# Altium project InterfacePCB.PrjPcb
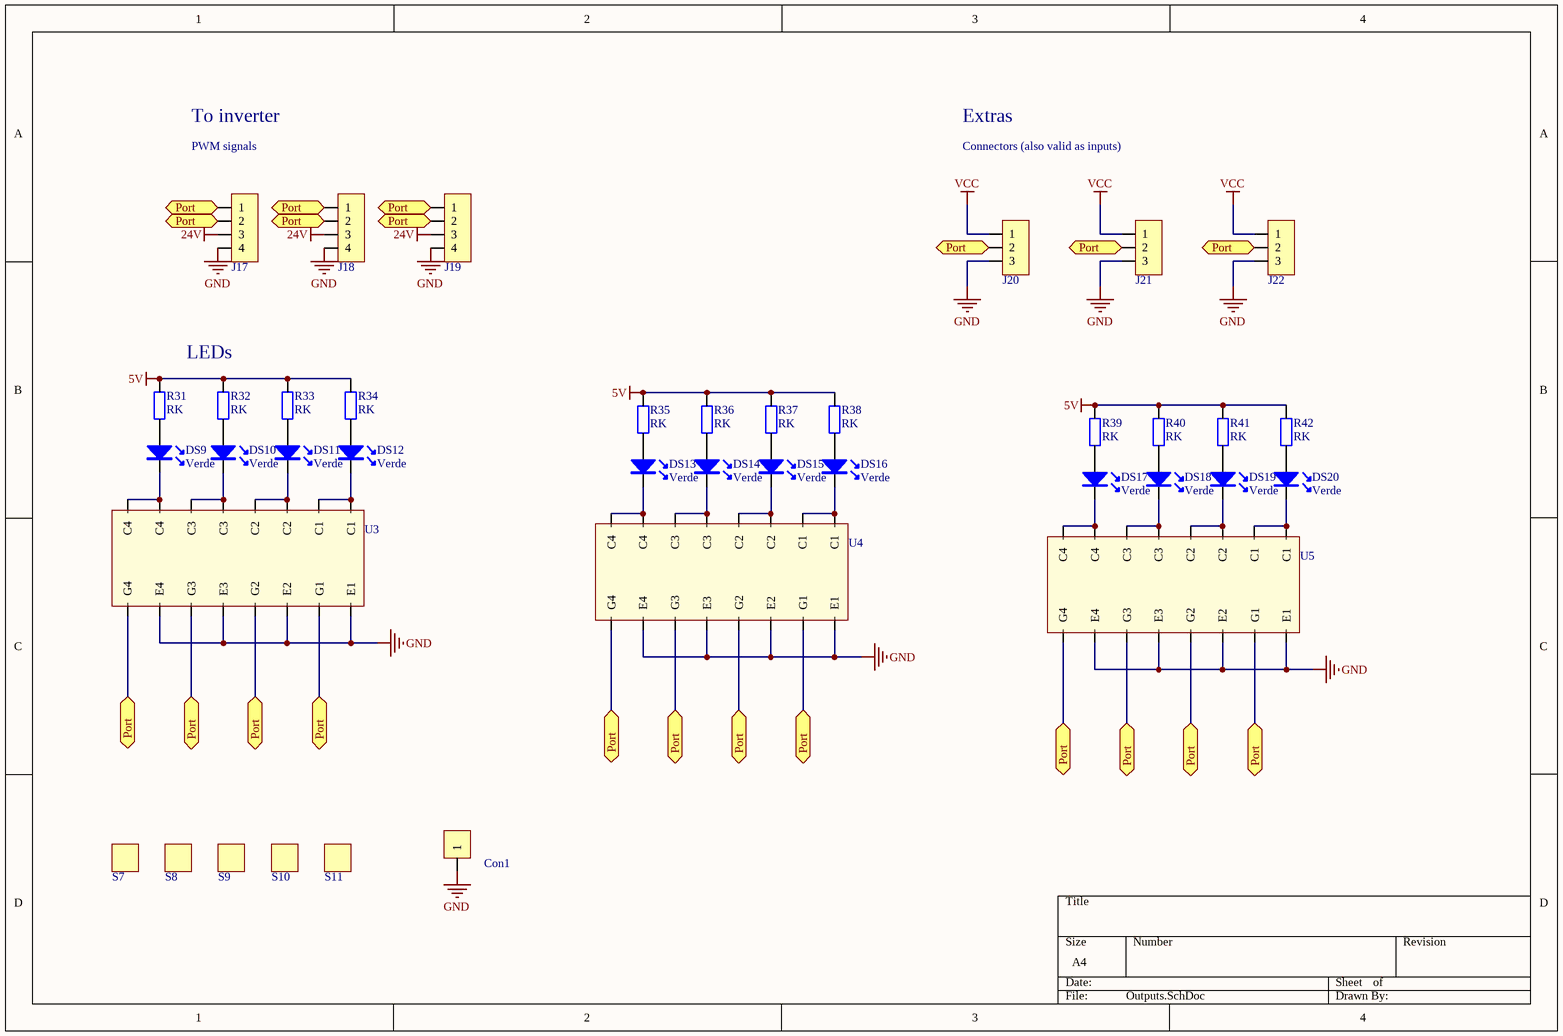
[diagram p0: Outputs.SchDoc]
6 sheets, 190 parts. Net scope: flat (ports and power ports of the same name join across sheets).
Board file: V1_PCB.PcbDoc
Sheets:
  Outputs.SchDoc
  InputsExtras.SchDoc
  DSP.SchDoc
  Supplies.SchDoc
  Inputs.SchDoc
  SignalProcessing.SchDoc

## Sheet Outputs.SchDoc
size A4

### Parts
Con1  CON1  [ShortPad]  (value not drawn)
DS9  Verde  [Led 3mm]
DS10  Verde  [Led 3mm]
DS11  Verde  [Led 3mm]
DS12  Verde  [Led 3mm]
DS13  Verde  [Led 3mm]
DS14  Verde  [Led 3mm]
DS15  Verde  [Led 3mm]
DS16  Verde  [Led 3mm]
DS17  Verde  [Led 3mm]
DS18  Verde  [Led 3mm]
DS19  Verde  [Led 3mm]
DS20  Verde  [Led 3mm]
J17  Cleva 2 vias  [Con4_KK_256]  (value not drawn)
J18  Cleva 2 vias  [Con4_KK_256]  (value not drawn)
J19  Cleva 2 vias  [Con4_KK_256]  (value not drawn)
J20  Cleva 2 vias  [Con3_KK_256]  (value not drawn)
J21  Cleva 2 vias  [Con3_KK_256]  (value not drawn)
J22  Cleva 2 vias  [Con3_KK_256]  (value not drawn)
R31  RK  [1206]
R32  RK  [1206]
R33  RK  [1206]
R34  RK  [1206]
R35  RK  [1206]
R36  RK  [1206]
R37  RK  [1206]
R38  RK  [1206]
R39  RK  [1206]
R40  RK  [1206]
R41  RK  [1206]
R42  RK  [1206]
S7  Support  [Support]  (value not drawn)
S8  Support  [Support]  (value not drawn)
S9  Support  [Support]  (value not drawn)
S10  Support  [Support]  (value not drawn)
S11  Support  [Support]  (value not drawn)
U3  MMPQ3904  [SO-16]  (value not drawn)
U4  MMPQ3904  [SO-16]  (value not drawn)
U5  MMPQ3904  [SO-16]  (value not drawn)

### Ports
Port

### Nets
5V: R31.1 R32.1 R33.1 R34.1 R35.1 R36.1 R37.1 R38.1 R39.1 R40.1 R41.1 R42.1
24V: J17.3 J18.3 J19.3
GND: Con1.1 J17.4 J18.4 J19.4 J20.3 J21.3 J22.3 U3.10(E4) U3.12(E3) U3.14(E2) U3.16(E1) U4.10(E4) U4.12(E3) U4.14(E2) U4.16(E1) U5.10(E4) U5.12(E3) U5.14(E2) U5.16(E1)
VCC: J20.1 J21.1 J22.1
NetC1_1: J17.1 J17.2 J18.1 J18.2 J19.1 J19.2 J20.2 J21.2 J22.2 U3.9(G4) U3.11(G3) U3.13(G2) U3.15(G1) U4.9(G4) U4.11(G3) U4.13(G2) U4.15(G1) U5.9(G4) U5.11(G3) U5.13(G2) U5.15(G1) ; port Port
NetDS9_A: DS9.A R31.2
NetDS9_K: DS9.K U3.7(C4) U3.8(C4)
NetDS10_A: DS10.A R32.2
NetDS10_K: DS10.K U3.5(C3) U3.6(C3)
NetDS11_A: DS11.A R33.2
NetDS11_K: DS11.K U3.3(C2) U3.4(C2)
NetDS12_A: DS12.A R34.2
NetDS12_K: DS12.K U3.1(C1) U3.2(C1)
NetDS13_A: DS13.A R35.2
NetDS13_K: DS13.K U4.7(C4) U4.8(C4)
NetDS14_A: DS14.A R36.2
NetDS14_K: DS14.K U4.5(C3) U4.6(C3)
NetDS15_A: DS15.A R37.2
NetDS15_K: DS15.K U4.3(C2) U4.4(C2)
NetDS16_A: DS16.A R38.2
NetDS16_K: DS16.K U4.1(C1) U4.2(C1)
NetDS17_A: DS17.A R39.2
NetDS17_K: DS17.K U5.7(C4) U5.8(C4)
NetDS18_A: DS18.A R40.2
NetDS18_K: DS18.K U5.5(C3) U5.6(C3)
NetDS19_A: DS19.A R41.2
NetDS19_K: DS19.K U5.3(C2) U5.4(C2)
NetDS20_A: DS20.A R42.2
NetDS20_K: DS20.K U5.1(C1) U5.2(C1)

### Notes on the sheet
- (near J17) PWM signals
- To inverter
- Extras
- Connectors (also valid as inputs)
- LEDs

### Library data of the parts
DS9-DS20 = Led
J17-J19 = Con_4
J20-J22 = Con_3
R31-R42 = Resistencia: Potencia: 1/4W

## Sheet InputsExtras.SchDoc
size A4
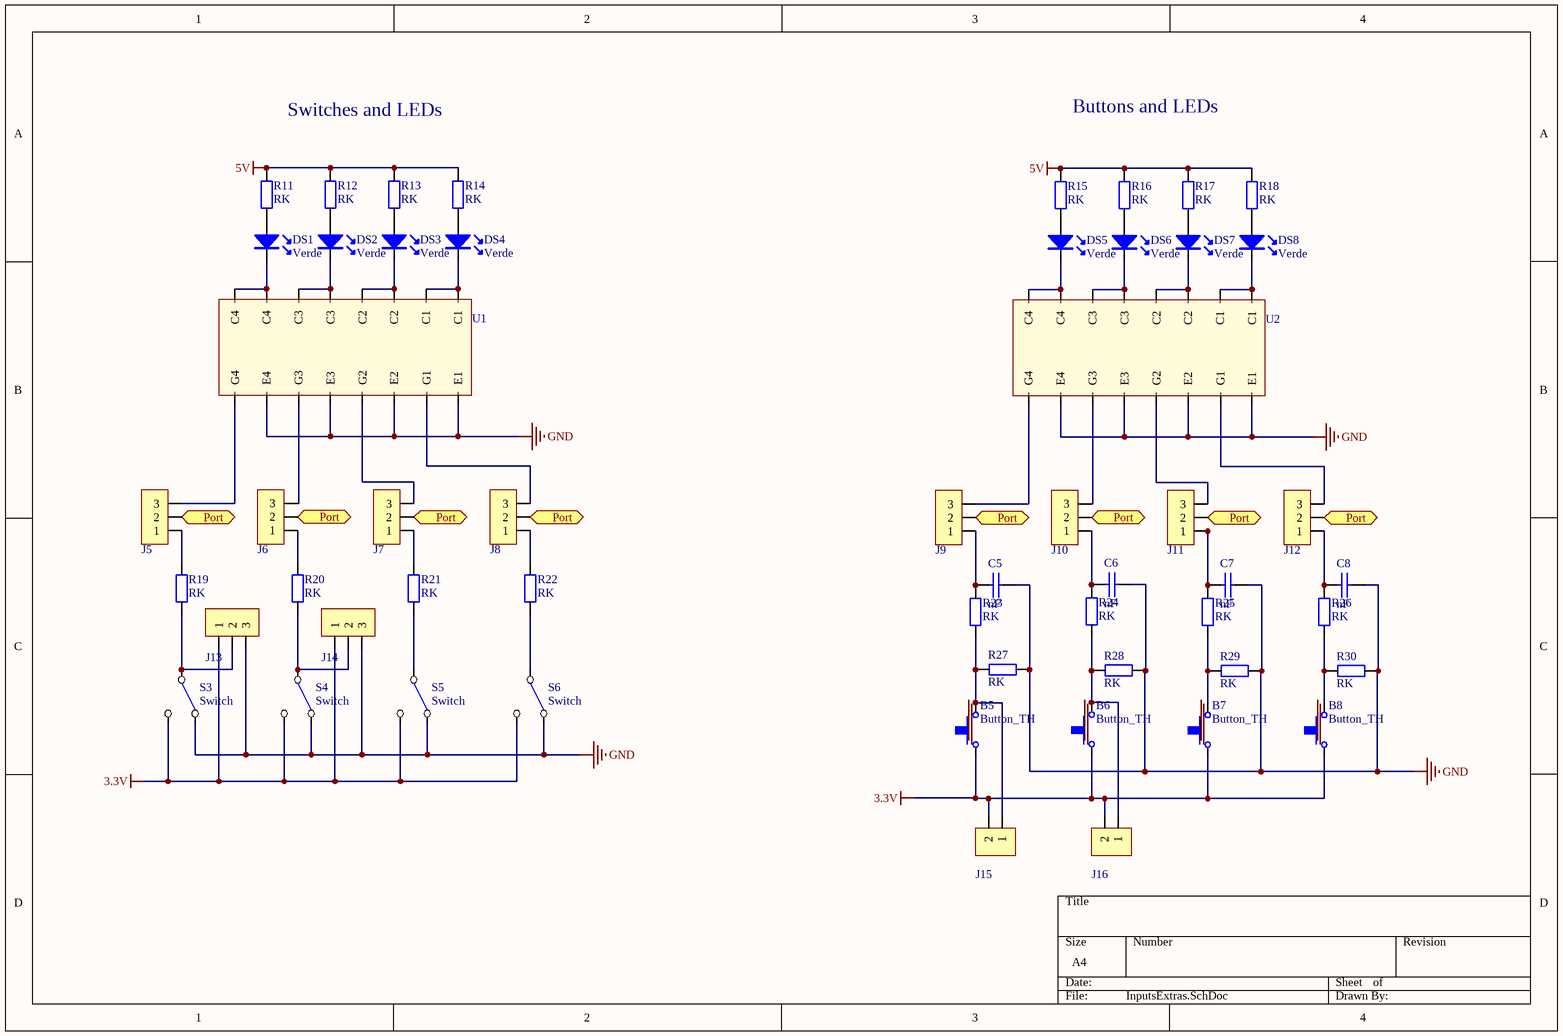
[diagram p1: InputsExtras.SchDoc]

### Parts
B5  Button_TH  [ButtonTH]
B6  Button_TH  [ButtonTH]
B7  Button_TH  [ButtonTH]
B8  Button_TH  [ButtonTH]
C5  nF  [1206]
C6  nF  [1206]
C7  nF  [1206]
C8  nF  [1206]
DS1  Verde  [Led 3mm]
DS2  Verde  [Led 3mm]
DS3  Verde  [Led 3mm]
DS4  Verde  [Led 3mm]
DS5  Verde  [Led 3mm]
DS6  Verde  [Led 3mm]
DS7  Verde  [Led 3mm]
DS8  Verde  [Led 3mm]
J5  Cleva 2 vias  [con_3_100milis]  (value not drawn)
J6  Cleva 2 vias  [con_3_100milis]  (value not drawn)
J7  Cleva 2 vias  [con_3_100milis]  (value not drawn)
J8  Cleva 2 vias  [con_3_100milis]  (value not drawn)
J9  Cleva 2 vias  [con_3_100milis]  (value not drawn)
J10  Cleva 2 vias  [con_3_100milis]  (value not drawn)
J11  Cleva 2 vias  [con_3_100milis]  (value not drawn)
J12  Cleva 2 vias  [con_3_100milis]  (value not drawn)
J13  Cleva 2 vias  [Con3_KK_256]  (value not drawn)
J14  Cleva 2 vias  [Con3_KK_256]  (value not drawn)
J15  Cleva 2 vias  [Con2_KK_256]  (value not drawn)
J16  Cleva 2 vias  [Con2_KK_256]  (value not drawn)
R11  RK  [1206]
R12  RK  [1206]
R13  RK  [1206]
R14  RK  [1206]
R15  RK  [1206]
R16  RK  [1206]
R17  RK  [1206]
R18  RK  [1206]
R19  RK  [1206]
R20  RK  [1206]
R21  RK  [1206]
R22  RK  [1206]
R23  RK  [1206]
R24  RK  [1206]
R25  RK  [1206]
R26  RK  [1206]
R27  RK  [1206]
R28  RK  [1206]
R29  RK  [1206]
R30  RK  [1206]
S3  Switch  [SwitchTH_2Pos]
S4  Switch  [SwitchTH_2Pos]
S5  Switch  [SwitchTH_2Pos]
S6  Switch  [SwitchTH_2Pos]
U1  MMPQ3904  [SO-16]  (value not drawn)
U2  MMPQ3904  [SO-16]  (value not drawn)

### Ports
Port

### Nets
3.3V: B5.1 B6.1 B7.1 B8.1 J13.1 J14.1 J15.2 J16.2 S3.2(ON2) S4.2(ON2) S5.2(ON2) S6.2(ON2)
5V: R11.1 R12.1 R13.1 R14.1 R15.1 R16.1 R17.1 R18.1
GND: C5.1 C6.1 C7.1 C8.1 J13.3 J14.3 R27.1 R28.1 R29.1 R30.1 S3.0(ON1) S4.0(ON1) S5.0(ON1) S6.0(ON1) U1.10(E4) U1.12(E3) U1.14(E2) U1.16(E1) U2.10(E4) U2.12(E3) U2.14(E2) U2.16(E1)
NetB5_0: B5.0 J15.1 R23.1 R27.2
NetB6_0: B6.0 J16.1 R24.1 R28.2
NetB7_0: B7.0 R25.1 R29.2
NetB8_0: B8.0 R26.1 R30.2
NetC1_1: J5.2 J6.2 J7.2 J8.2 J9.2 J10.2 J11.2 J12.2 ; port Port
NetC5_2: C5.2 J9.1 R23.2
NetC6_2: C6.2 J10.1 R24.2
NetC7_2: C7.2 J11.1 R25.2
NetC8_2: C8.2 J12.1 R26.2
NetDS1_A: DS1.A R11.2
NetDS1_K: DS1.K U1.7(C4) U1.8(C4)
NetDS2_A: DS2.A R12.2
NetDS2_K: DS2.K U1.5(C3) U1.6(C3)
NetDS3_A: DS3.A R13.2
NetDS3_K: DS3.K U1.3(C2) U1.4(C2)
NetDS4_A: DS4.A R14.2
NetDS4_K: DS4.K U1.1(C1) U1.2(C1)
NetDS5_A: DS5.A R15.2
NetDS5_K: DS5.K U2.7(C4) U2.8(C4)
NetDS6_A: DS6.A R16.2
NetDS6_K: DS6.K U2.5(C3) U2.6(C3)
NetDS7_A: DS7.A R17.2
NetDS7_K: DS7.K U2.3(C2) U2.4(C2)
NetDS8_A: DS8.A R18.2
NetDS8_K: DS8.K U2.1(C1) U2.2(C1)
NetJ5_1: J5.1 R19.2
NetJ5_3: J5.3 U1.9(G4)
NetJ6_1: J6.1 R20.2
NetJ6_3: J6.3 U1.11(G3)
NetJ7_1: J7.1 R21.2
NetJ7_3: J7.3 U1.13(G2)
NetJ8_1: J8.1 R22.2
NetJ8_3: J8.3 U1.15(G1)
NetJ9_3: J9.3 U2.9(G4)
NetJ10_3: J10.3 U2.11(G3)
NetJ11_3: J11.3 U2.13(G2)
NetJ12_3: J12.3 U2.15(G1)
NetJ13_2: J13.2 R19.1 S3.1(COMMON)
NetJ14_2: J14.2 R20.1 S4.1(COMMON)
NetR21_1: R21.1 S5.1(COMMON)
NetR22_1: R22.1 S6.1(COMMON)

### Notes on the sheet
- Buttons and LEDs
- Switches and LEDs

### Library data of the parts
C5-C8 = Condensador
DS1-DS8 = Led
J5-J14 = Con_3
J15 J16 = Con_2
R11-R30 = Resistencia: Potencia: 1/4W

## Sheet DSP.SchDoc
size A4
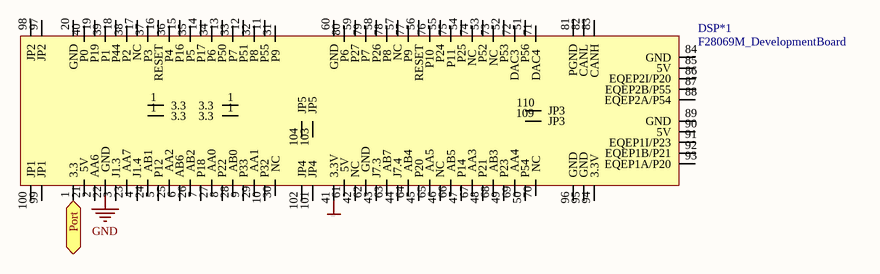
[diagram p2: DSP.SchDoc]

### Parts
DSP*1  F28069M_DevelopmentBoard  [F28069M_DevelopmentBoard]

### Ports
Port

### Nets
GND: DSP*1.22(GND)
VCC: DSP*1.41(3.3V)
NetC1_1: DSP*1.1(3.3) ; port Port

Not connected (* = marked no-connect by the designer): DSP*1 2(AA6) 3(J1.3) 4(J1.4) 5(P12) 6(AB6) 7(P18) 8(P22) 9(P33) 10(P32) 11(P55) 12(P51) 13(P50) 14(P17) 15(P16) 16(RESET) 17(NC) 18(P44) 19(P19) 20(GND) 21(5V) 23(AA7) 24(AB1) 25(AA2) 26(AB2) 27(AA0) 28(AB0) 29(AA1) 30(NC) 31(P9) 32(P8) 33(P7) 34(P6) 35(P5) 36(P4) 37(P3) 38(P2) 39(P1) 40(P0) 42(NC) 43(J7.3) 44(J7.4) 45(P20) 46(NC) 47(P14) 48(P21) 49(P23) 50(P54) 51(P56) 52(P53) 53(P52) 54(P25) 55(P24) 56(RESET) 57(NC) 58(P26) 59(P27) 60(GND) 61(5V) 62(GND) 63(AB7) 64(AB4) 65(AA5) 66(AB5) 67(AA3) 68(AB3) 69(AA4) 70(NC) 71(DAC4) 72(DAC3) 73(NC) 74(NC) 75(P11) 76(P10) 77(P9) 78(P8) 79(P7) 80(P6) 81(PGND) 82(CANL) 83(CANH) 84(GND) 85(5V) 86(EQEP2I/P20) 87(EQEP2B/P55) 88(EQEP2A/P54) 89(GND) 90(5V) 91(EQEP1I/P23) 92(EQEP1B/P21) 93(EQEP1A/P20) 94(3.3V) 95(GND) 96(GND) 97(JP2) 98(JP2) 99(JP1) 100(JP1) 101(JP4) 102(JP4) 103(JP5) 104(JP5) 109(JP3) 110(JP3)

## Sheet Supplies.SchDoc
size A4
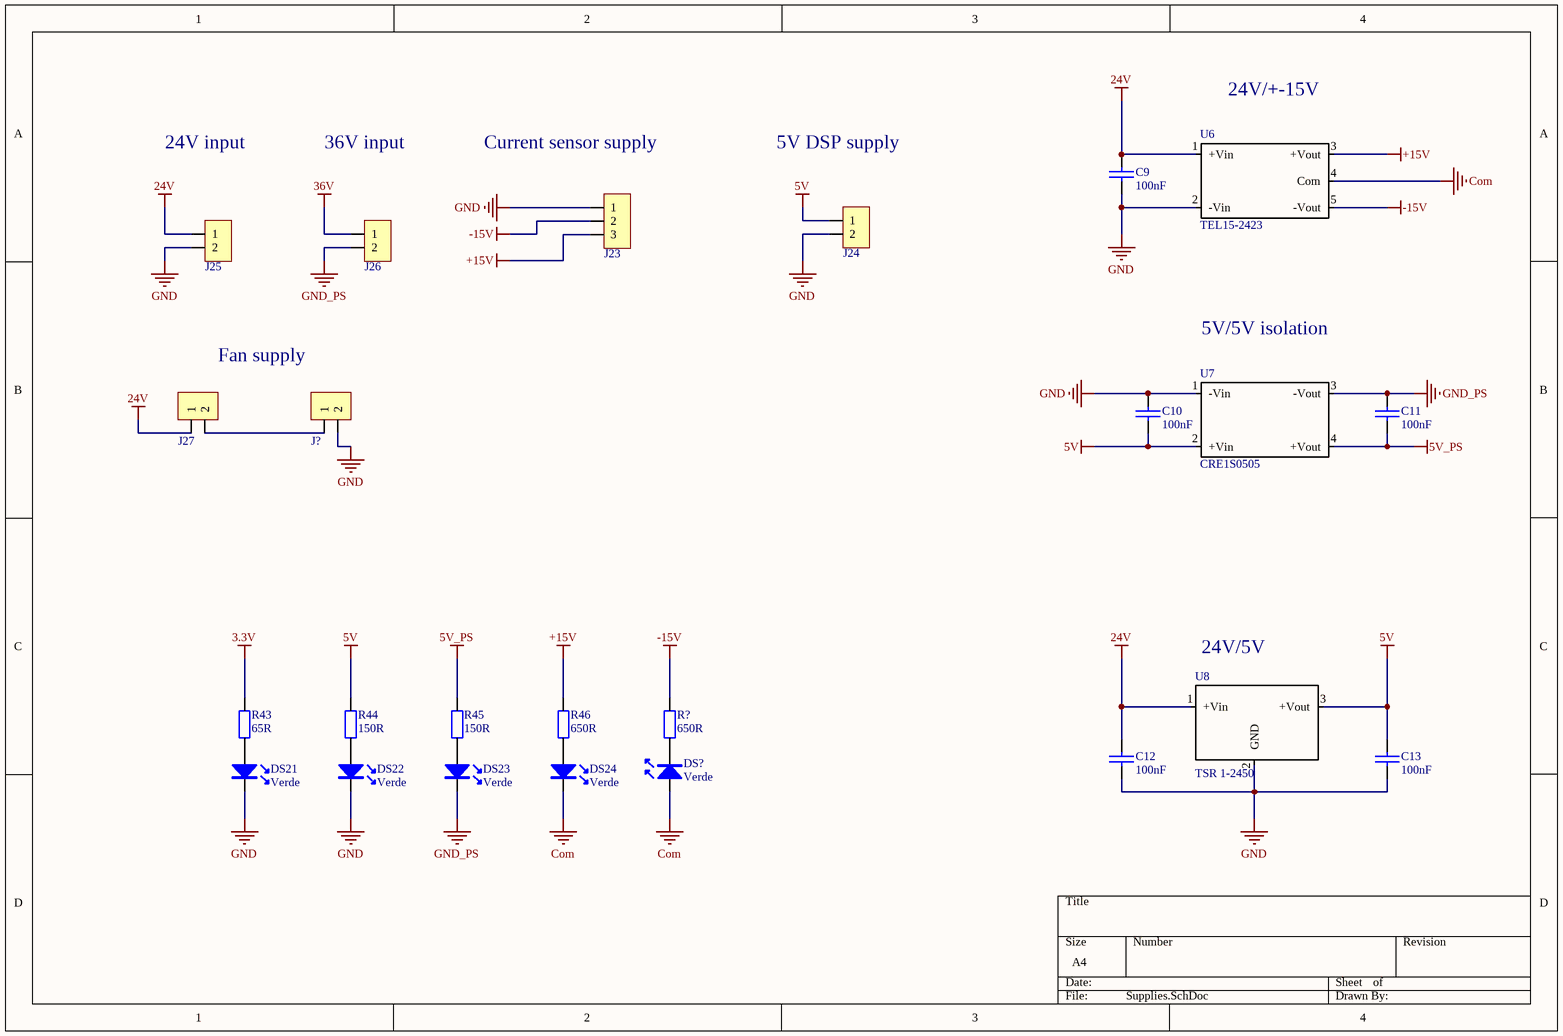
[diagram p3: Supplies.SchDoc]

### Parts
C9  100nF  [1206]
C10  100nF  [1206]
C11  100nF  [1206]
C12  100nF  [1206]
C13  100nF  [1206]
DS21  Verde  [Led 3mm]
DS22  Verde  [Led 3mm]
DS23  Verde  [Led 3mm]
DS24  Verde  [Led 3mm]
DS?  Verde  [Led 3mm]
J23  Cur_meas_con  [Con3_KK_256]  (value not drawn)
J24  Cleva 2 vias  [Clema_2_vias]  (value not drawn)
J25  Cleva 2 vias  [Con2_KK_256]  (value not drawn)
J26  Cleva 2 vias  [Con2_KK_256]  (value not drawn)
J27  Cleva 2 vias  [Con2_KK_256]  (value not drawn)
J?  Cleva 2 vias  [Con2_KK_256]  (value not drawn)
R43  65R  [1206]
R44  150R  [1206]
R45  150R  [1206]
R46  650R  [1206]
R?  650R  [1206]
U6  TEL15-2423  [TEL15-2423]
U7  CRE1S0505  [CRE1S0505SC]
U8  TSR 1-2450  [TSR 1-2450]

### Nets
3.3V: R43.1
5V: C10.2 C13.1 J24.1 R44.1 U7.2(+Vin) U8.3(+Vout)
5V_PS: C11.2 R45.1 U7.4(+Vout)
24V: C9.1 C12.1 J25.1 J27.1 U6.1(+Vin) U8.1(+Vin)
36V: J26.1
+15V: J23.3 R46.1 U6.3(+Vout)
-15V: J23.2 R?.1 U6.5(-Vout)
Com: DS24.K DS?.A U6.4(Com)
GND: C9.2 C10.1 C12.2 C13.2 DS21.K DS22.K J23.1 J24.2 J25.2 J?.2 U6.2(-Vin) U7.1(-Vin) U8.2(GND)
GND_PS: C11.1 DS23.K J26.2 U7.3(-Vout)
NetDS21_A: DS21.A R43.2
NetDS22_A: DS22.A R44.2
NetDS23_A: DS23.A R45.2
NetDS24_A: DS24.A R46.2
NetDS?_K: DS?.K R?.2
NetJ27_2: J27.2 J?.1

### Notes on the sheet
- (near U6) 24V/+-15V
- 24V input
- 36V input
- (near J23) Current sensor supply
- 5V DSP supply
- Fan supply
- 5V/5V isolation
- (near U8) 24V/5V

### Library data of the parts
C9-C13 = Condensador
DS21-DS24 DS? = Led
J23 = Con_3
J24-J27 J? = Con_2
R43-R46 R? = Resistencia: Potencia: 1/4W

## Sheet Inputs.SchDoc
size A4
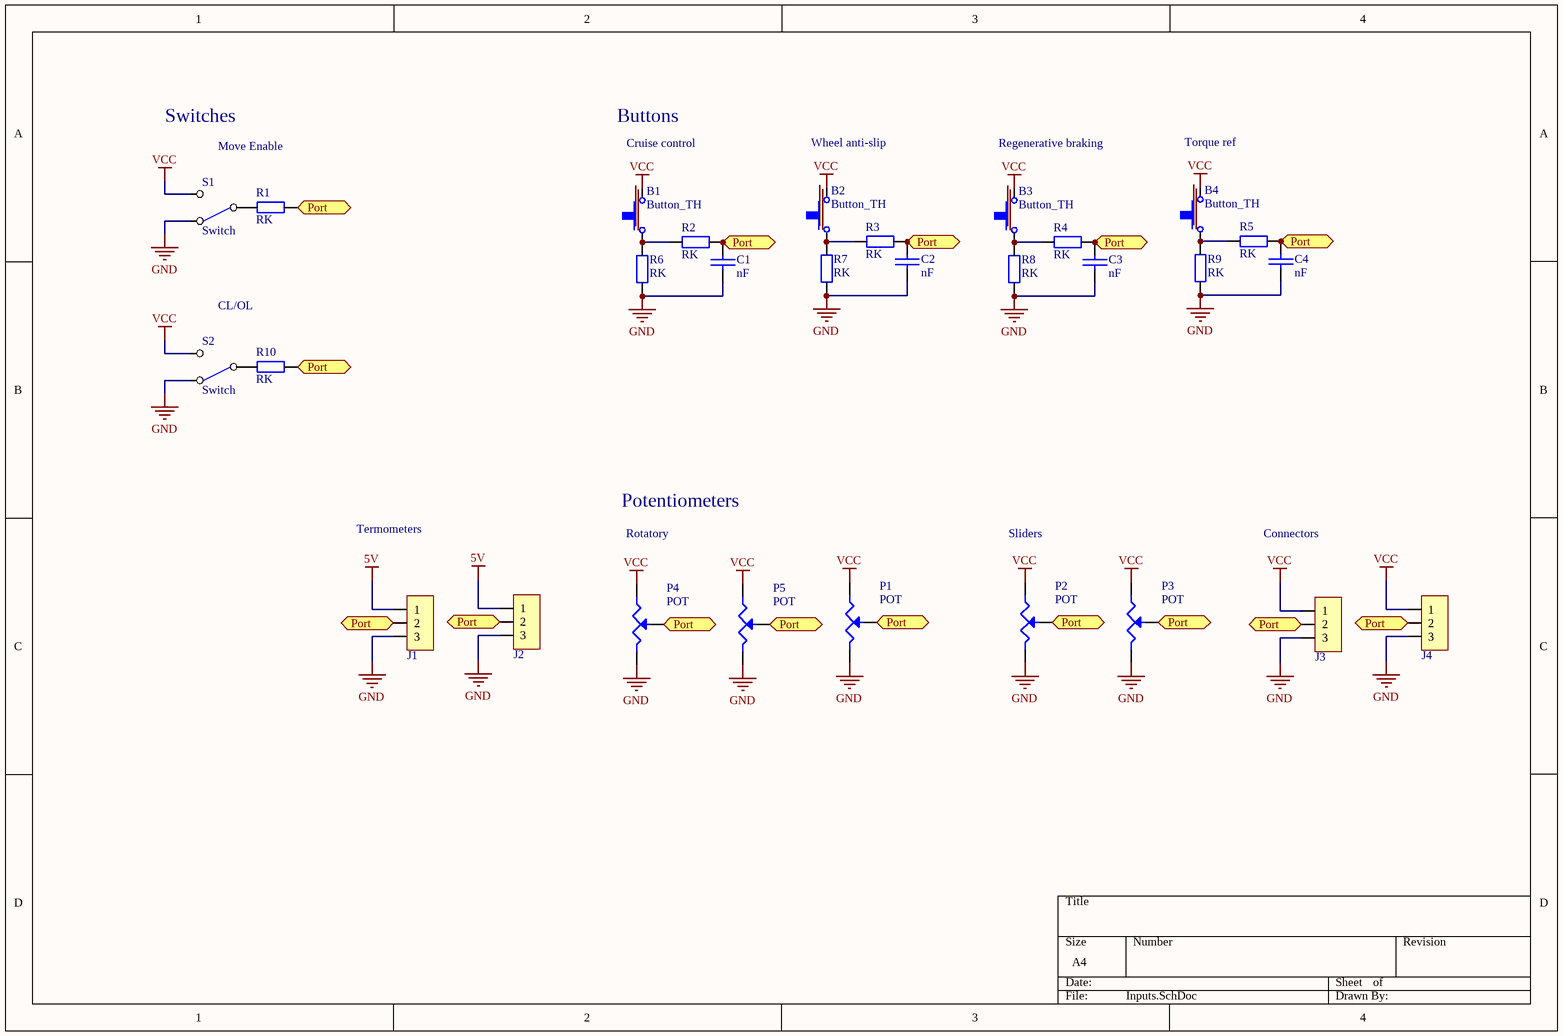
[diagram p4: Inputs.SchDoc]

### Parts
B1  Button_TH  [ButtonTH]
B2  Button_TH  [ButtonTH]
B3  Button_TH  [ButtonTH]
B4  Button_TH  [ButtonTH]
C1  nF  [1206]
C2  nF  [1206]
C3  nF  [1206]
C4  nF  [1206]
J1  Cleva 2 vias  [Con3_KK_256]  (value not drawn)
J2  Cleva 2 vias  [Con3_KK_256]  (value not drawn)
J3  Cleva 2 vias  [Con3_KK_256]  (value not drawn)
J4  Cleva 2 vias  [Con3_KK_256]  (value not drawn)
P1  POT  [POT_RK11K1140A3L]
P2  POT  [SliderPot_PTA6044]
P3  POT  [SliderPot_PTA6044]
P4  POT  [POT_RK11K1140A3L]
P5  POT  [POT_RK11K1140A3L]
R1  RK  [1206]
R2  RK  [1206]
R3  RK  [1206]
R4  RK  [1206]
R5  RK  [1206]
R6  RK  [1206]
R7  RK  [1206]
R8  RK  [1206]
R9  RK  [1206]
R10  RK  [1206]
S1  Switch  [SwitchTH_2Pos]
S2  Switch  [SwitchTH_2Pos]

### Ports
Port

### Nets
5V: J1.1 J2.1
GND: C1.2 C2.2 C3.2 C4.2 J1.3 J2.3 J3.3 J4.3 P1.3 P2.3 P3.3 P4.3 P5.3 R6.2 R7.2 R8.2 R9.2 S1.0(ON1) S2.0(ON1)
VCC: B1.0 B2.0 B3.0 B4.0 J3.1 J4.1 P1.1 P2.1 P3.1 P4.1 P5.1 S1.2(ON2) S2.2(ON2)
NetB1_1: B1.1 R2.2 R6.1
NetB2_1: B2.1 R3.2 R7.1
NetB3_1: B3.1 R4.2 R8.1
NetB4_1: B4.1 R5.2 R9.1
NetC1_1: C1.1 C2.1 C3.1 C4.1 J1.2 J2.2 J3.2 J4.2 P1.2 P2.2 P3.2 P4.2 P5.2 R1.2 R2.1 R3.1 R4.1 R5.1 R10.2 ; port Port
NetR1_1: R1.1 S1.1(COMMON)
NetR10_1: R10.1 S2.1(COMMON)

### Notes on the sheet
- Switches
- Move Enable
- Buttons
- (near B1) Cruise control
- (near B2) Wheel anti-slip
- (near B3) Regenerative braking
- (near B4) Torque ref
- CL/OL
- Potentiometers
- Termometers
- Rotatory
- (near P2) Sliders
- Connectors

### Library data of the parts
C1-C4 = Condensador
J1-J4 = Con_3
P1-P5 = POT: POTENCIOMETRO
R1-R10 = Resistencia: Potencia: 1/4W

## Sheet SignalProcessing.SchDoc
size A4
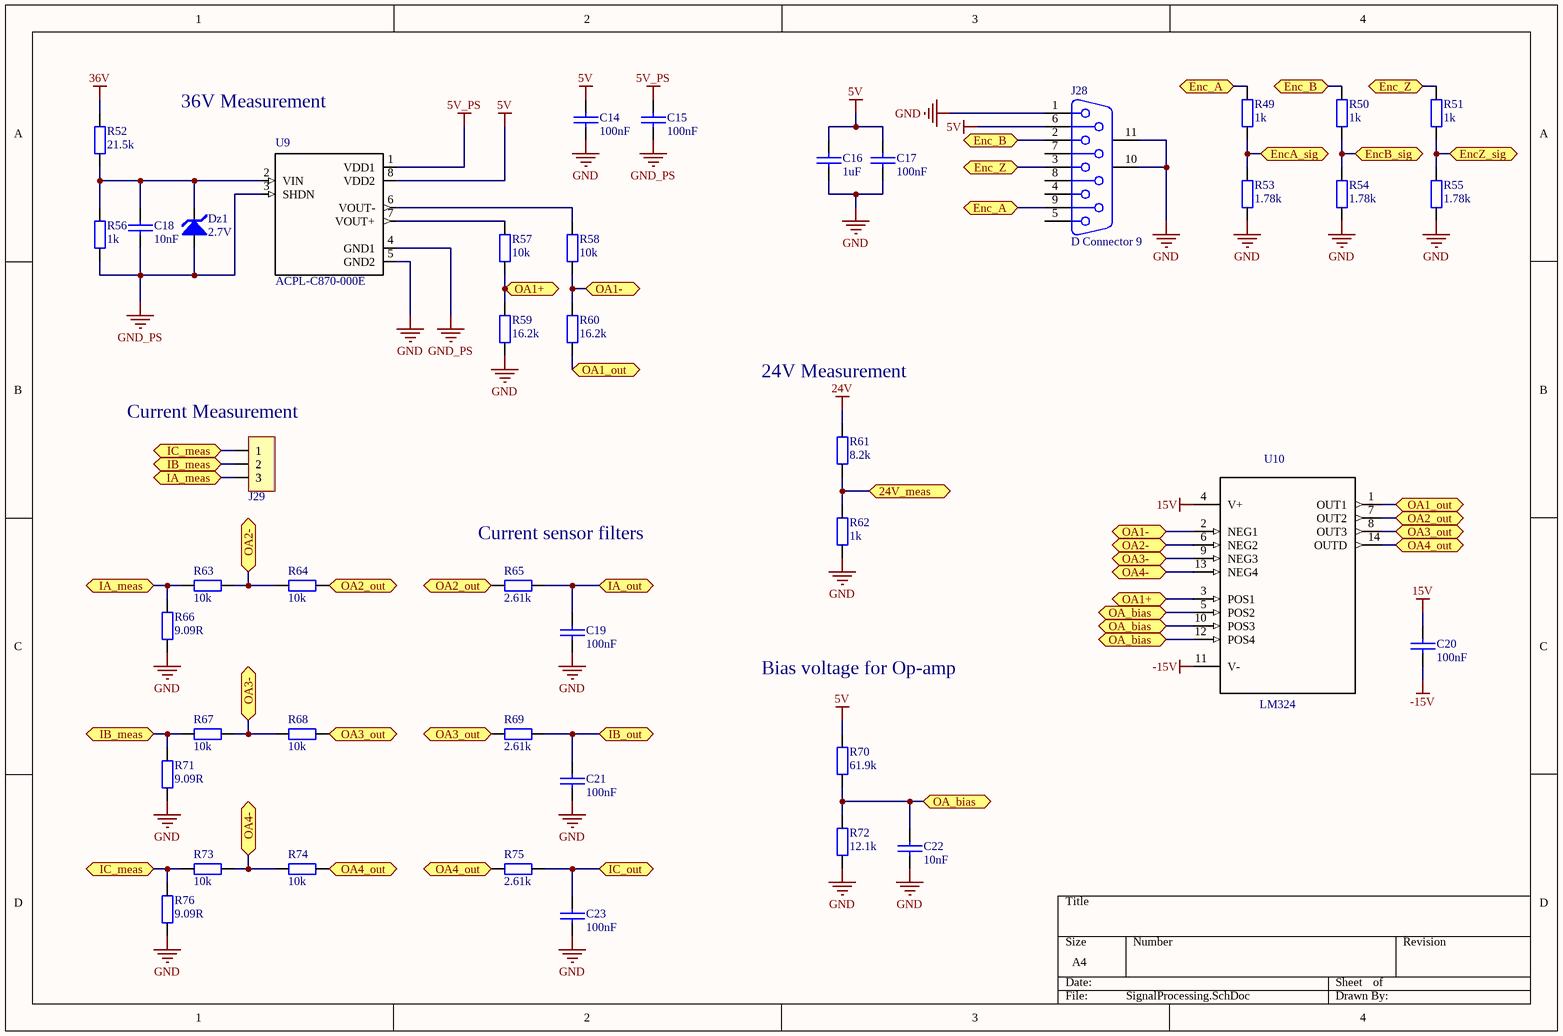
[diagram p5: SignalProcessing.SchDoc]

### Parts
C14  100nF  [1206]
C15  100nF  [1206]
C16  1uF  [1206]
C17  100nF  [1206]
C18  10nF  [1206]
C19  100nF  [1206]
C20  100nF  [1206]
C21  100nF  [1206]
C22  10nF  [1206]
C23  100nF  [1206]
Dz1  2.7V  [Diodo]
J28  D Connector 9  [DSUB1.385-2H9]
J29  Cleva 2 vias  [Con3_KK_256]  (value not drawn)
R49  1k  [1206]
R50  1k  [1206]
R51  1k  [1206]
R52  21.5k  [1206]
R53  1.78k  [1206]
R54  1.78k  [1206]
R55  1.78k  [1206]
R56  1k  [1206]
R57  10k  [1206]
R58  10k  [1206]
R59  16.2k  [1206]
R60  16.2k  [1206]
R61  8.2k  [1206]
R62  1k  [1206]
R63  10k  [1206]
R64  10k  [1206]
R65  2.61k  [1206]
R66  9.09R  [1206]
R67  10k  [1206]
R68  10k  [1206]
R69  2.61k  [1206]
R70  61.9k  [1206]
R71  9.09R  [1206]
R72  12.1k  [1206]
R73  10k  [1206]
R74  10k  [1206]
R75  2.61k  [1206]
R76  9.09R  [1206]
U9  ACPL-C870-000E  [SOIC127P1150X360-8N]
U10  LM324  [SOIC_14]

### Ports
24V_meas, Enc_A, Enc_B, Enc_Z, EncA_sig, EncB_sig, EncZ_sig, IA_meas, IA_out, IB_meas, IB_out, IC_meas, IC_out, OA1+, OA1-, OA1_out, OA2-, OA2_out, OA3-, OA3_out, OA4-, OA4_out, OA_bias

### Nets
5V: C14.1 C16.1 C17.1 J28.6 R70.2 U9.8(VDD2)
5V_PS: C15.1 U9.1(VDD1)
15V: C20.1 U10.4(V+)
24V: R61.1
36V: R52.1
-15V: C20.2 U10.11(V-)
GND: C14.2 C16.2 C17.2 C19.2 C21.2 C22.2 C23.2 J28.1 J28.10(MH1) J28.11(MH2) R53.1 R54.1 R55.1 R59.2 R62.2 R66.2 R71.2 R72.1 R76.2 U9.5(GND2)
GND_PS: C15.2 C18.2 Dz1.1(A) R56.2 U9.3(SHDN) U9.4(GND1)
NetC18_1: C18.1 Dz1.2(K) R52.2 R56.1 U9.2(VIN)
NetC19_1: C19.1 R65.2 ; port IA_out
NetC21_1: C21.1 R69.2 ; port IB_out
NetC22_1: C22.1 R70.1 R72.2 U10.5(POS2) U10.10(POS3) U10.12(POS4) ; port OA_bias
NetC23_1: C23.1 R75.2 ; port IC_out
NetJ28_2: J28.2 R50.2 ; port Enc_B
NetJ28_3: J28.3 R51.2 ; port Enc_Z
NetJ28_9: J28.9 R49.2 ; port Enc_A
NetJ29_1: J29.1 R73.1 R76.1 ; port IC_meas
NetJ29_2: J29.2 R67.1 R71.1 ; port IB_meas
NetJ29_3: J29.3 R63.1 R66.1 ; port IA_meas
NetR49_1: R49.1 R53.2 ; port EncA_sig
NetR50_1: R50.1 R54.2 ; port EncB_sig
NetR51_1: R51.1 R55.2 ; port EncZ_sig
NetR57_1: R57.1 U9.7(VOUT+)
NetR57_2: R57.2 R59.1 U10.3(POS1) ; port OA1+
NetR58_1: R58.1 R60.1 U10.2(NEG1) ; port OA1-
NetR58_2: R58.2 U9.6(VOUT-)
NetR60_2: R60.2 U10.1(OUT1) ; port OA1_out
NetR61_2: R61.2 R62.1 ; port 24V_meas
NetR63_2: R63.2 R64.1 U10.6(NEG2) ; port OA2-
NetR64_2: R64.2 R65.1 U10.7(OUT2) ; port OA2_out
NetR67_2: R67.2 R68.1 U10.9(NEG3) ; port OA3-
NetR68_2: R68.2 R69.1 U10.8(OUT3) ; port OA3_out
NetR73_2: R73.2 R74.1 U10.13(NEG4) ; port OA4-
NetR74_2: R74.2 R75.1 U10.14(OUTD) ; port OA4_out

Not connected (* = marked no-connect by the designer): J28 4 5 7 8

### Notes on the sheet
- 36V Measurement
- 24V Measurement
- (near J29) Current Measurement
- (near R65) Current sensor filters
- Bias voltage for Op-amp

### Library data of the parts
C14-C23 = Condensador
Dz1 = Zener
J28 = D Connector 9: Receptacle Assembly, 9 Position, Right Angle; PackageDocument: O; Positions: 9; Published: 15-Jun-2001; LatestRevisionDate: 17-Jul-2002; LatestRevisionNote: Re-released for DXP Platform.; DatasheetDocument: 1-Sep-1999; PackageReference: 788750; Publisher: Altium Limited; Orientation: Right Angle; Gender: Receptacle
J29 = Con_3
R49-R76 = Resistencia: Potencia: 1/4W
U9 = ACPL-C870-000E: Isolation Amplifier [Broadcom] ACPL-C870-000E Isolation Amplifier; MF: Broadcom Limited; Package: SO-8 Broadcom; Digi-Key_Part_Number: 516-2578-5-ND; MP: ACPL-C870-000E; Digi-Key_Purchase_URL: https://www.digikey.dk/product-detail/en/broadcom-limited/ACPL-C870-000E/516-2578-5-ND/3523705?utm_source=snapeda&utm_medium=aggregator&utm_campaign=symbol; SnapEDA_Link: https://www.snapeda.com/parts/ACPL-C870-000E/Broadcom%20Limited/view-part/?ref=snap; Value: *
U10 = LMC6484IM_1: 14 pin CMOS Quad Rail to Rail Input and Output Operational Amplifier 55 per tube; MF: Texas Instruments; Price: None; MP: LMC6484IM; SnapEDA_Link: https://www.snapeda.com/parts/LMC6484IM/Texas%20Instruments/view-part/?ref=snap; Availability: Unavailable; Package: SOIC-14 Texas Instruments; Value: *

## Nets that join several sheets
3.3V: InputsExtras (12 pins), Supplies (R43.1)
5V: Outputs (12 pins), InputsExtras (8 pins), Supplies (6 pins), Inputs (J1.1 J2.1), SignalProcessing (6 pins)
5V_PS: Supplies (C11.2 R45.1 U7.4), SignalProcessing (C15.1 U9.1)
24V: Outputs (J17.3 J18.3 J19.3), Supplies (6 pins), SignalProcessing (R61.1)
36V: Supplies (J26.1), SignalProcessing (R52.1)
-15V: Supplies (J23.2 R?.1 U6.5), SignalProcessing (C20.2 U10.11)
GND: Outputs (19 pins), InputsExtras (22 pins), DSP (DSP*1.22), Supplies (13 pins), Inputs (19 pins), SignalProcessing (20 pins)
GND_PS: Supplies (C11.1 DS23.K J26.2 U7.3), SignalProcessing (6 pins)
VCC: Outputs (J20.1 J21.1 J22.1), DSP (DSP*1.41), Inputs (13 pins)
NetC1_1: Outputs (21 pins), InputsExtras (8 pins), DSP (DSP*1.1), Inputs (19 pins)